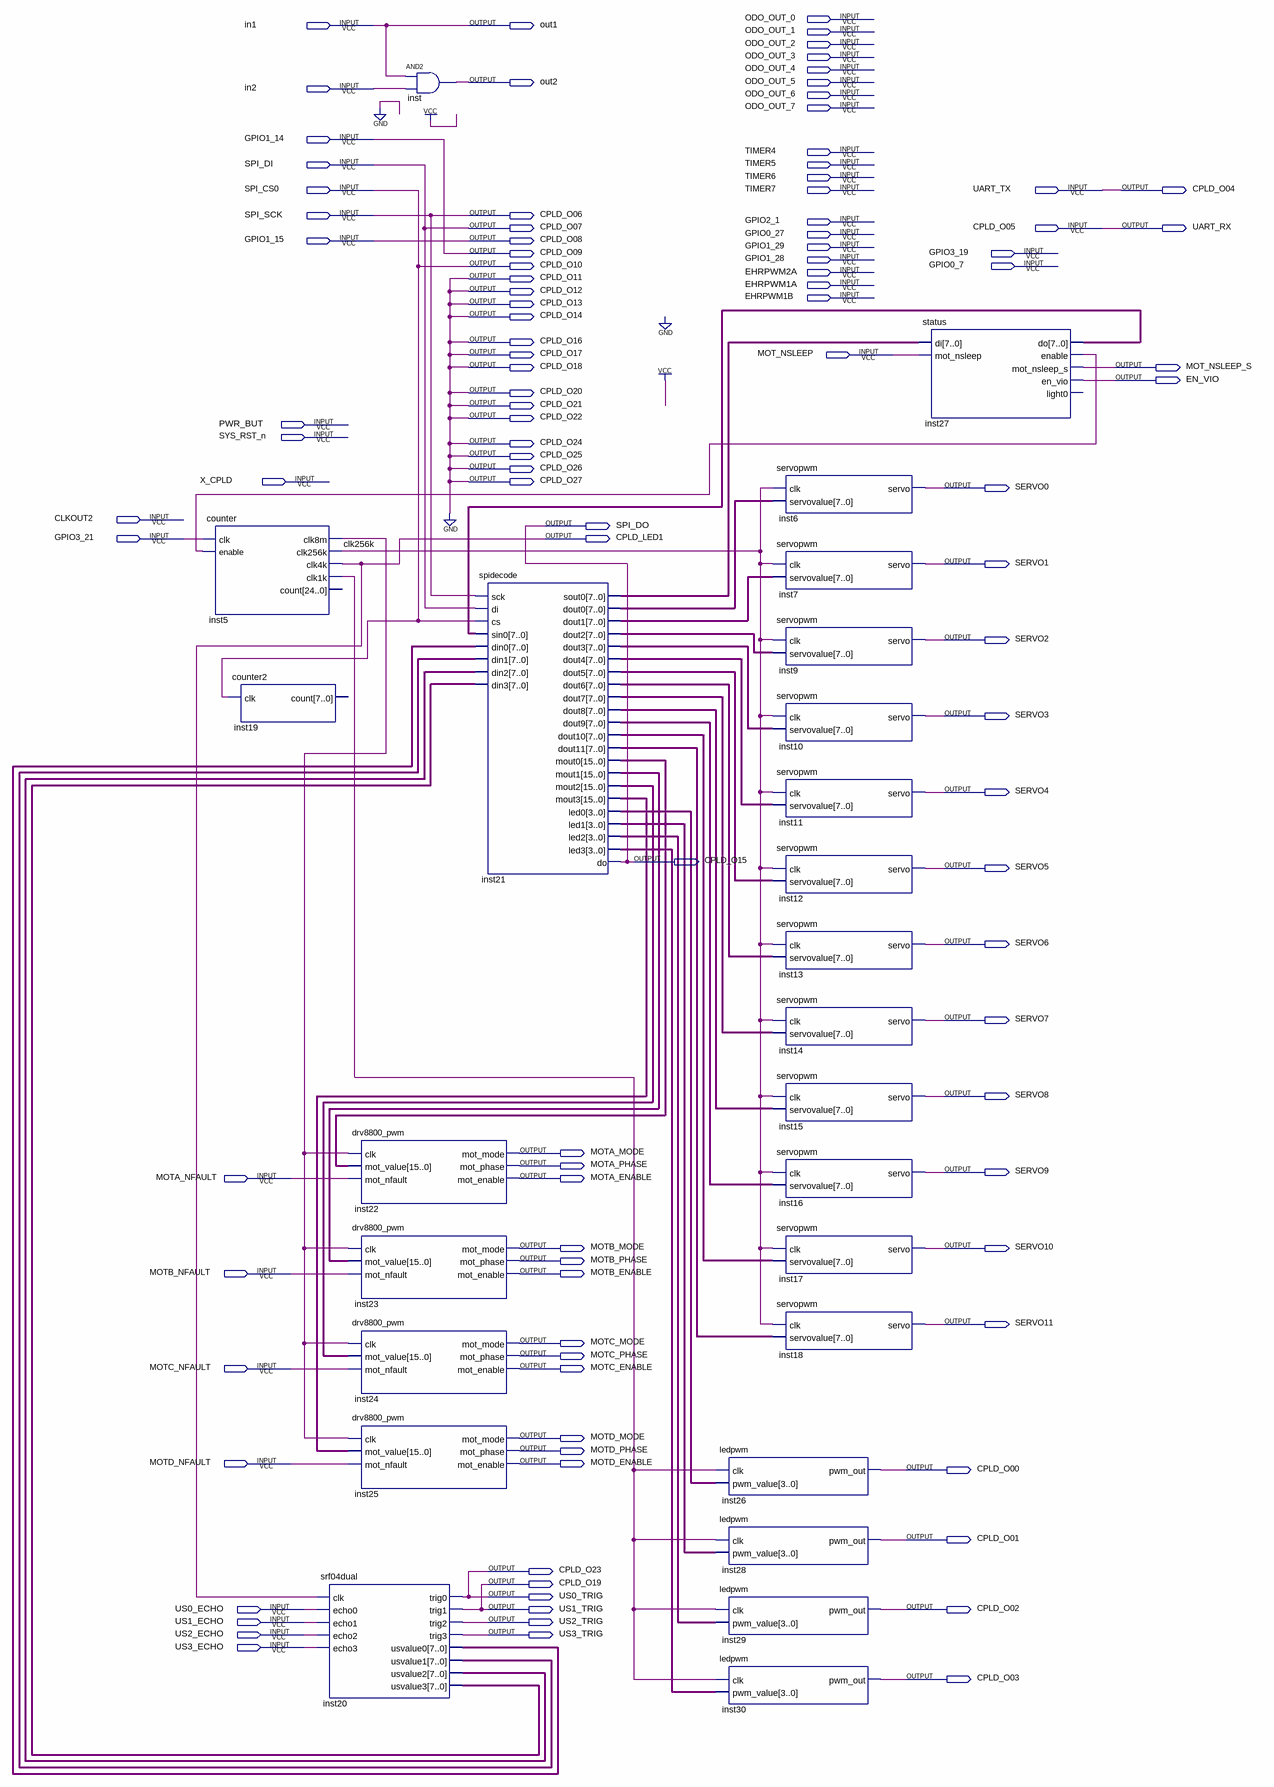
[diagram p0: schematic sheet]
// Quartus schematic bb-cpld.bdf as structural Verilog: 26 symbols, 106 pins
module \bb-cpld  (
  input  ODO_OUT_0,
  input  in1,
  input  ODO_OUT_1,
  input  ODO_OUT_2,
  input  ODO_OUT_3,
  input  ODO_OUT_4,
  input  ODO_OUT_5,
  input  in2,
  input  ODO_OUT_6,
  input  ODO_OUT_7,
  input  GPIO1_14,
  input  TIMER4,
  input  SPI_DI,
  input  TIMER5,
  input  TIMER6,
  input  SPI_CS0,
  input  TIMER7,
  input  UART_TX,
  input  SPI_SCK,
  input  GPIO2_1,
  input  CPLD_O05,
  input  GPIO0_27,
  input  GPIO1_15,
  input  GPIO1_29,
  input  GPIO3_19,
  input  GPIO1_28,
  input  GPIO0_7,
  input  EHRPWM2A,
  input  EHRPWM1A,
  input  EHRPWM1B,
  input  MOT_NSLEEP,
  input  PWR_BUT,
  input  SYS_RST_n,
  input  X_CPLD,
  input  CLKOUT2,
  input  GPIO3_21,
  input  MOTA_NFAULT,
  input  MOTB_NFAULT,
  input  MOTC_NFAULT,
  input  MOTD_NFAULT,
  input  US0_ECHO,
  input  US1_ECHO,
  input  US2_ECHO,
  input  US3_ECHO,
  output out1,
  output out2,
  output CPLD_O04,
  output CPLD_O06,
  output CPLD_O07,
  output UART_RX,
  output CPLD_O08,
  output CPLD_O09,
  output CPLD_O10,
  output CPLD_O11,
  output CPLD_O12,
  output CPLD_O13,
  output CPLD_O14,
  output CPLD_O16,
  output CPLD_O17,
  output CPLD_O18,
  output MOT_NSLEEP_S,
  output EN_VIO,
  output CPLD_O20,
  output CPLD_O21,
  output CPLD_O22,
  output CPLD_O24,
  output CPLD_O25,
  output CPLD_O26,
  output CPLD_O27,
  output SERVO0,
  output SPI_DO,
  output CPLD_LED1,
  output SERVO1,
  output SERVO2,
  output SERVO3,
  output SERVO4,
  output CPLD_O15,
  output SERVO5,
  output SERVO6,
  output SERVO7,
  output SERVO8,
  output MOTA_MODE,
  output MOTA_PHASE,
  output SERVO9,
  output MOTA_ENABLE,
  output MOTB_MODE,
  output SERVO10,
  output MOTB_PHASE,
  output MOTB_ENABLE,
  output SERVO11,
  output MOTC_MODE,
  output MOTC_PHASE,
  output MOTC_ENABLE,
  output MOTD_MODE,
  output MOTD_PHASE,
  output MOTD_ENABLE,
  output CPLD_O00,
  output CPLD_O01,
  output CPLD_O23,
  output CPLD_O19,
  output US0_TRIG,
  output US1_TRIG,
  output CPLD_O02,
  output US2_TRIG,
  output US3_TRIG,
  output CPLD_O03
);

  wire clk256k, inst5_clk1k, inst5_clk8m, inst27_enable;
  wire [3:0] inst21_led0, inst21_led1, inst21_led2, inst21_led3;
  wire [7:0] inst20_usvalue0, inst20_usvalue1, inst20_usvalue2, inst20_usvalue3, inst21_dout0, inst21_dout1,
       inst21_dout2, inst21_dout3, inst21_dout4, inst21_dout5, inst21_dout6, inst21_dout7, inst21_dout8,
       inst21_dout9, inst21_dout10, inst21_dout11, inst21_sout0, inst27_do;
  wire [15:0] inst21_mout0, inst21_mout1, inst21_mout2, inst21_mout3;

  counter inst5 (
    .clk(GPIO3_21), .enable(inst27_enable), .clk8m(inst5_clk8m), .clk256k(clk256k), .clk4k(CPLD_LED1),
    .clk1k(inst5_clk1k));  // open: count
  counter2 inst19 (.clk(SPI_CS0));  // open: count
  srf04dual inst20 (
    .clk(CPLD_LED1), .echo0(US0_ECHO), .echo1(US1_ECHO), .echo2(US2_ECHO), .echo3(US3_ECHO),
    .trig0(CPLD_O23), .trig1(CPLD_O19), .trig2(US2_TRIG), .trig3(US3_TRIG), .usvalue0(inst20_usvalue0),
    .usvalue1(inst20_usvalue1), .usvalue2(inst20_usvalue2), .usvalue3(inst20_usvalue3));
  drv8800_pwm inst22 (
    .clk(inst5_clk8m), .mot_value(inst21_mout0), .mot_nfault(MOTA_NFAULT), .mot_mode(MOTA_MODE),
    .mot_phase(MOTA_PHASE), .mot_enable(MOTA_ENABLE));
  drv8800_pwm inst23 (
    .clk(inst5_clk8m), .mot_value(inst21_mout1), .mot_nfault(MOTB_NFAULT), .mot_mode(MOTB_MODE),
    .mot_phase(MOTB_PHASE), .mot_enable(MOTB_ENABLE));
  drv8800_pwm inst24 (
    .clk(inst5_clk8m), .mot_value(inst21_mout2), .mot_nfault(MOTC_NFAULT), .mot_mode(MOTC_MODE),
    .mot_phase(MOTC_PHASE), .mot_enable(MOTC_ENABLE));
  drv8800_pwm inst25 (
    .clk(inst5_clk8m), .mot_value(inst21_mout3), .mot_nfault(MOTD_NFAULT), .mot_mode(MOTD_MODE),
    .mot_phase(MOTD_PHASE), .mot_enable(MOTD_ENABLE));
  and inst (out2, in1, in2);
  spidecode inst21 (
    .sck(SPI_SCK), .di(SPI_DI), .cs(SPI_CS0), .sin0(inst27_do), .din0(inst20_usvalue0),
    .din1(inst20_usvalue1), .din2(inst20_usvalue2), .din3(inst20_usvalue3), .sout0(inst21_sout0),
    .dout0(inst21_dout0), .dout1(inst21_dout1), .dout2(inst21_dout2), .dout3(inst21_dout3),
    .dout4(inst21_dout4), .dout5(inst21_dout5), .dout6(inst21_dout6), .dout7(inst21_dout7),
    .dout8(inst21_dout8), .dout9(inst21_dout9), .dout10(inst21_dout10), .dout11(inst21_dout11),
    .mout0(inst21_mout0), .mout1(inst21_mout1), .mout2(inst21_mout2), .mout3(inst21_mout3),
    .led0(inst21_led0), .led1(inst21_led1), .led2(inst21_led2), .led3(inst21_led3), .\do (CPLD_O15));
  ledpwm inst26 (.clk(inst5_clk1k), .pwm_value(inst21_led0), .pwm_out(CPLD_O00));
  ledpwm inst28 (.clk(inst5_clk1k), .pwm_value(inst21_led1), .pwm_out(CPLD_O01));
  ledpwm inst29 (.clk(inst5_clk1k), .pwm_value(inst21_led2), .pwm_out(CPLD_O02));
  ledpwm inst30 (.clk(inst5_clk1k), .pwm_value(inst21_led3), .pwm_out(CPLD_O03));
  servopwm inst6 (.clk(clk256k), .servovalue(inst21_dout0), .servo(SERVO0));
  servopwm inst7 (.clk(clk256k), .servovalue(inst21_dout1), .servo(SERVO1));
  servopwm inst9 (.clk(clk256k), .servovalue(inst21_dout2), .servo(SERVO2));
  servopwm inst10 (.clk(clk256k), .servovalue(inst21_dout3), .servo(SERVO3));
  servopwm inst11 (.clk(clk256k), .servovalue(inst21_dout4), .servo(SERVO4));
  servopwm inst12 (.clk(clk256k), .servovalue(inst21_dout5), .servo(SERVO5));
  servopwm inst13 (.clk(clk256k), .servovalue(inst21_dout6), .servo(SERVO6));
  servopwm inst14 (.clk(clk256k), .servovalue(inst21_dout7), .servo(SERVO7));
  servopwm inst15 (.clk(clk256k), .servovalue(inst21_dout8), .servo(SERVO8));
  servopwm inst16 (.clk(clk256k), .servovalue(inst21_dout9), .servo(SERVO9));
  servopwm inst17 (.clk(clk256k), .servovalue(inst21_dout10), .servo(SERVO10));
  servopwm inst18 (.clk(clk256k), .servovalue(inst21_dout11), .servo(SERVO11));
  status inst27 (
    .di(inst21_sout0), .mot_nsleep(MOT_NSLEEP), .\do (inst27_do), .enable(inst27_enable),
    .mot_nsleep_s(MOT_NSLEEP_S), .en_vio(EN_VIO));  // open: light0

  assign CPLD_O04 = UART_TX;
  assign CPLD_O06 = SPI_SCK;
  assign CPLD_O07 = SPI_DI;
  assign CPLD_O08 = GPIO1_15;
  assign CPLD_O09 = GPIO1_14;
  assign CPLD_O10 = SPI_CS0;
  assign CPLD_O11 = 1'b0;
  assign CPLD_O12 = 1'b0;
  assign CPLD_O13 = 1'b0;
  assign CPLD_O14 = 1'b0;
  assign CPLD_O16 = 1'b0;
  assign CPLD_O17 = 1'b0;
  assign CPLD_O18 = 1'b0;
  assign CPLD_O20 = 1'b0;
  assign CPLD_O21 = 1'b0;
  assign CPLD_O22 = 1'b0;
  assign CPLD_O24 = 1'b0;
  assign CPLD_O25 = 1'b0;
  assign CPLD_O26 = 1'b0;
  assign CPLD_O27 = 1'b0;
  assign out1 = in1;
  assign SPI_DO = CPLD_O15;
  assign UART_RX = CPLD_O05;
  assign US0_TRIG = CPLD_O23;
  assign US1_TRIG = CPLD_O19;
endmodule
